# Altium project c3_hw_1.PrjPcb
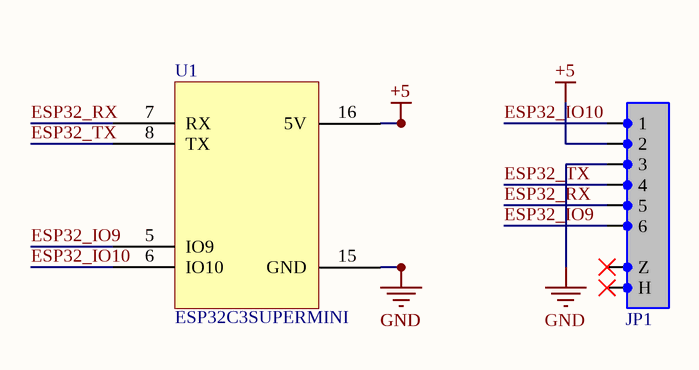
[diagram p0: c3_hw_1.SchDoc]
1 sheet, 2 parts. Net scope: global (net labels, ports and power ports of the same name join across sheets).
Board file: c3_hw_1.PcbDoc

## Sheet c3_hw_1.SchDoc
size A4; SheetNumber: 1; SheetTotal: 1

### Parts
JP1  HDR-1X6  [HDR2.54-LI-6P]  (value not drawn)
U1  ESP32C3SUPERMINI  [ESP32C3SUPERMINI]

### Nets
+5: JP1.2 U1.16(5V)
GND: JP1.3 U1.15(GND)
ESP32_IO9: JP1.6 U1.5(IO9)
ESP32_IO10: JP1.1 U1.6(IO10)
ESP32_RX: JP1.5 U1.7(RX)
ESP32_TX: JP1.4 U1.8(TX)

Not connected (* = marked no-connect by the designer): JP1 0(Z)* 100(H)*

### Library data of the parts
JP1 = Header 6: 6P接插件; 版权归属: 源创客; BOM名称: 6P接插件; 学习资源: www.ooocke.com